# Altium schematic sheet SMP ASCII.SchDoc
size A3; DocumentNumber: 1; SheetNumber: 1; SheetTotal: 2
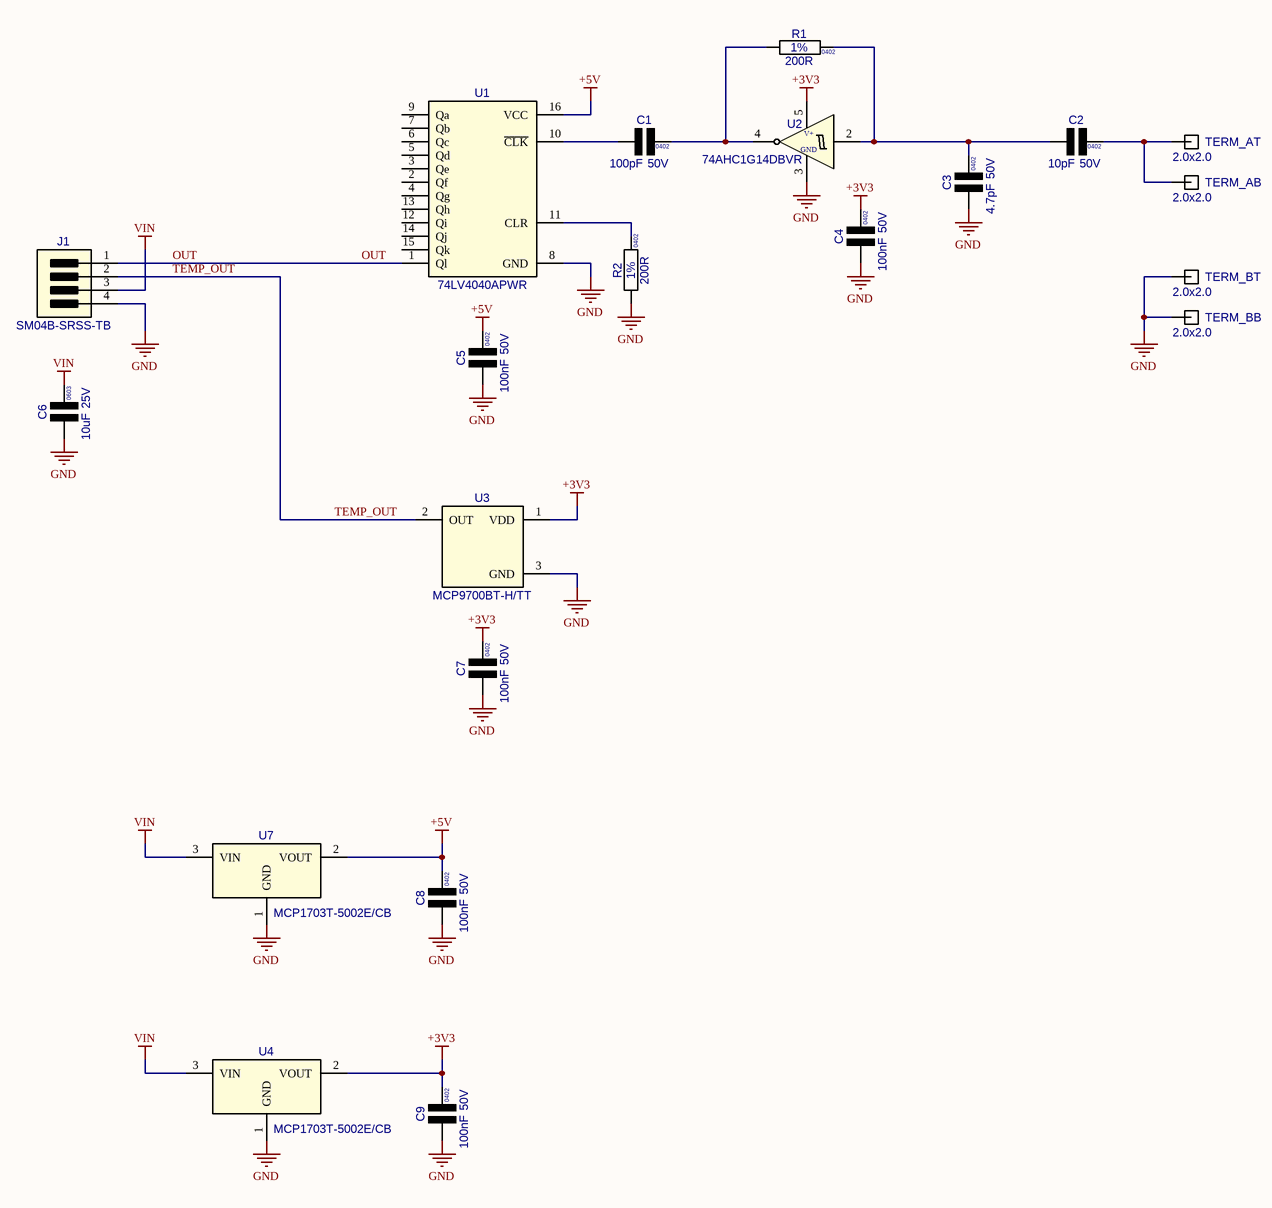
[diagram p0: SMP ASCII.SchDoc]

## Parts
C1  value 100pF  Voltage: 50V  Text1: 0402  [CAPC0402X60N]  (hidden comment: 100pF_C0402_50V_10%_C0G/NP0)
C2  value 10pF  Voltage: 50V  Text1: 0402  [CAPC0402X60N]  (hidden comment: 10pF_C0402_50V_5%_C0G/NP0)
C3  value 4.7pF  Voltage: 50V  Text1: 0402  [CAPC0402X60N]  (hidden comment: 4.7pF_C0402_50V_5%_C0G/NP0)
C4  value 100nF  Voltage: 50V  Text1: 0402  [CAPC0402X60N]  (hidden comment: 100nF_C0402_50V_5%_X5R)
C5  value 100nF  Voltage: 50V  Text1: 0402  [CAPC0402X60N]  (hidden comment: 100nF_C0402_50V_5%_X5R)
C6  value 10uF  Voltage: 25V  Text1: 0603  [CAPC0603X85N]  (hidden comment: 10uF_C0603_25V_10%_X5R)
C7  value 100nF  Voltage: 50V  Text1: 0402  [CAPC0402X60N]  (hidden comment: 100nF_C0402_50V_5%_X5R)
C8  value 100nF  Voltage: 50V  Text1: 0402  [CAPC0402X60N]  (hidden comment: 100nF_C0402_50V_5%_X5R)
C9  value 100nF  Voltage: 50V  Text1: 0402  [CAPC0402X60N]  (hidden comment: 100nF_C0402_50V_5%_X5R)
J1  SM04B-SRSS-TB  [SM04B-SRSS-TB]
R1  value 200R  Tol: 1%  Text1: 0402  [RESC0402X40N]  (hidden comment: 200R_R0402_1%)
R2  value 200R  Tol: 1%  Text1: 0402  [RESC0402X40N]  (hidden comment: 200R_R0402_1%)
TERM_AB  Part Number: 2.0x2.0  [PAD-SMD-2.0x2.0mm Rect]  (hidden comment: Pad-SMD-2.0x2.0mm-H_Rectangle)  (no BOM)
TERM_AT  Part Number: 2.0x2.0  [PAD-SMD-2.0x2.0mm Rect]  (hidden comment: Pad-SMD-2.0x2.0mm-H_Rectangle)  (no BOM)
TERM_BB  Part Number: 2.0x2.0  [PAD-SMD-2.0x2.0mm Rect]  (hidden comment: Pad-SMD-2.0x2.0mm-H_Rectangle)  (no BOM)
TERM_BT  Part Number: 2.0x2.0  [PAD-SMD-2.0x2.0mm Rect]  (hidden comment: Pad-SMD-2.0x2.0mm-H_Rectangle)  (no BOM)
U1  74LV4040APWR  [TSSOP16-4.5x5.0]
U2  74AHC1G14DBVR  [SOT23-5]
U3  MCP9700BT-H/TT  [SOT23]
U4  MCP1703T-5002E/CB  [SOT23A]
U7  MCP1703T-5002E/CB  [SOT23A]

## Nets
+3V3: C4.1 C7.1 C9.1 U2.5(V+) U3.1(VDD) U4.2(VOUT)
+5V: C5.1 C8.1 U1.16(VCC) U7.2(VOUT)
GND: C3.2 C4.2 C5.2 C6.2 C7.2 C8.2 C9.2 J1.4 R2.1 TERM_BB.1 TERM_BT.1 U1.8(GND) U2.3(GND) U3.3(GND) U4.1(GND) U7.1(GND)
VIN: C6.1 J1.3 U4.3(VIN) U7.3(VIN)
OUT: J1.1 U1.1(Ql)
TEMP_OUT: J1.2 U3.2(OUT)
NetC1_1: C1.1 R1.1 U2.4(Y)
NetC1_2: C1.2 U1.10(~{CLK})
NetC2_1: C2.1 TERM_AB.1 TERM_AT.1
NetC2_2: C2.2 C3.1 R1.2 U2.2(A)
NetR2_2: R2.2 U1.11(CLR)

Not connected (* = marked no-connect by the designer): U1 2(Qf) 3(Qe) 4(Qg) 5(Qd) 6(Qc) 7(Qb) 9(Qa) 12(Qi) 13(Qh) 14(Qj) 15(Qk); U2 1(NC)

## Notes on the sheet
- NOTES:
- DOCUMENT IDENTIFICATION
- DRAWN
- REVIEWED
- APPROVED
- DOCUMENT APPROVAL
- QA
- CM
- DATE
- ECR NO.
- TITLE:
- DOC NUMBER:
- SOURCE FILE:
- VER:
- SHEET
- DOC REV:
- OF

## Library data of the parts
C1 = 100pF_0402N_50V_10%_C0G/NP0: Cap Ceramic C0G/NP0; Manufacturer: Various; Part Number: 100pF 0402 50V 10% C0G/NP0; DCE Part No: 9732; EDM-PN: CAP802; Tol: 10%; Package: CAPC0402X60N; Text2: *; SAAB PN: *; ADASI PN: *; Supplier 1: *; Supplier Part Number 1: *; ARAS PN: *
C2 = 10pF_0402N_50V_5%_C0G/NP0: Cap Ceramic C0G/NP0; Manufacturer: Various; Part Number: 10pF 0402 50V 5% C0G/NP0; DCE Part No: 7194; EDM-PN: CAP1008; Tol: 5%; Package: CAPC0402X60N; Text2: *; SAAB PN: *; ADASI PN: *; Supplier 1: *; Supplier Part Number 1: *; ARAS PN: *
C3 = 4.7pF_0402N_50V_5%_C0G/NP0: Cap Ceramic C0G/NP0; Manufacturer: Various; Part Number: 4.7pF 0402 50V 5% C0G/NP0; EDM-PN: CAP1308; Tol: 5%; Package: CAPC0402X60N; Text2: *; SAAB PN: *; DCE Part No: *; ADASI PN: *; Supplier 1: *; Supplier Part Number 1: *; ARAS PN: *
C4 C5 C7-C9 = 100nF_0402N_50V_5%_X5R: Cap Ceramic X5R; Manufacturer: Various; Part Number: 100nF 0402 50V 5% X5R; Tol: 5%; Package: CAPC0402X60N; EDM-PN: *; Text2: *; SAAB PN: *; DCE Part No: *; ADASI PN: *; Supplier 1: *; Supplier Part Number 1: *; ARAS PN: *
C6 = 10uF_0603N_25V_10%_X5R: Cap Ceramic X5R; Manufacturer: Various; Part Number: 10uF 0603 25V 10% X5R; EDM-PN: CAP1460; Tol: 10%; Package: CAPC0603X85N; Text2: *; SAAB PN: *; DCE Part No: *; ADASI PN: *; Supplier 1: Digi-Key; Supplier Part Number 1: 490-18214-1-ND; ARAS PN: *
J1 = SM04B-SRSS-TB: Connector Wire to Board 1.0mm Rt Angle; Manufacturer: JST; Package: SM04B-SRSS-TB; EDM-PN: *; Text2: *; Text1: *; Part Number: SM04B-SRSS-TB; Reutech PN: *; Supplier 1: Digi-Key; Supplier Part Number 1: 455-SM04B-SRSS-TBCT-ND; ARAS PN: *; Value: SM04B-SRSS-TB
R1 R2 = 200R_0402: Resistor Chip SMD; Manufacturer: Various; Part Number: 200R 0402 1%; Watt: 63mW; EDM-PN: RES654; Package: RESC0402X40N; Text2: *; Reutech PN: *; SAAB PN: *; DCE Part No: *; ADASI PN: *; Supplier 1: *; Supplier Part Number 1: *; ARAS PN: *
TERM_AB TERM_AT TERM_BB TERM_BT = Pad-SMD-2.0x2.0mm_Rectangle: Surface Mount Pad 2.0x2.0mm Rectangle; Manufacturer: NA; Value: SMD 2.0x2.0mm Rectangle; Package: PAD-SMD-2.0x2.0mm Rect; EDM-PN: *; Text2: *; Text1: *; SAAB PN: *; Reutech PN: *; ADASI PN: *; Supplier 1: *; Supplier Part Number 1: *; ARAS PN: *
U1 = 74LV4040APWR_TSSOP16: IC 12-Bit Binary Ripple Counter; Manufacturer: Texas; Package: TSSOP16-4.5x5.0; EDM-PN: *; Text2: *; Text1: *; Value: 74LV4040APWR; Part Number: 74LV4040APWR
U2 = 74AHC1G14DBVR_SOT23-5: IC Single Schmitt-Trigger Inverter; Manufacturer: Texas; Package: SOT23-5; EDM-PN: *; Text2: *; Text1: *; Value: 74AHC1G14DBVR; SAAB PN: *; DCE Part No: *; Part Number: 74AHC1G14DBVR; Supplier 1: Digi-Key; Supplier Part Number 1: 296-1092-1-ND; ARAS PN: *
U3 = MCP9700BT-h/TT-SOT23: IC Temperature Sensor -40 to 150 C; Manufacturer: Microchip; Package: SOT23; EDM-PN: *; Text2: *; Text1: *; Value: MCP9700BT-H/TT; DCE Part No: *; Supplier 1: Digi-Key; Supplier Part Number 1: 150-MCP9700BT-H/TTCT-ND; Part Number: MCP9700BT-H/TT
U4 U7 = MCP1703T-5002E/CB_SOT23A: Voltage Regulator LDO 250mA; Manufacturer: Microchip; Package: SOT23A; EDM-PN: *; Text2: *; Text1: *; Value: MCP1703T-5002E/CB; SAAB PN: *; DCE Part No: *; ADASI PN: *; Supplier 1: *; Supplier Part Number 1: *; ARAS PN: *; Part Number: MCP1703T-5002E/CB